# EAGLE schematic Small_Ethernet (EAGLE 7.3.0)
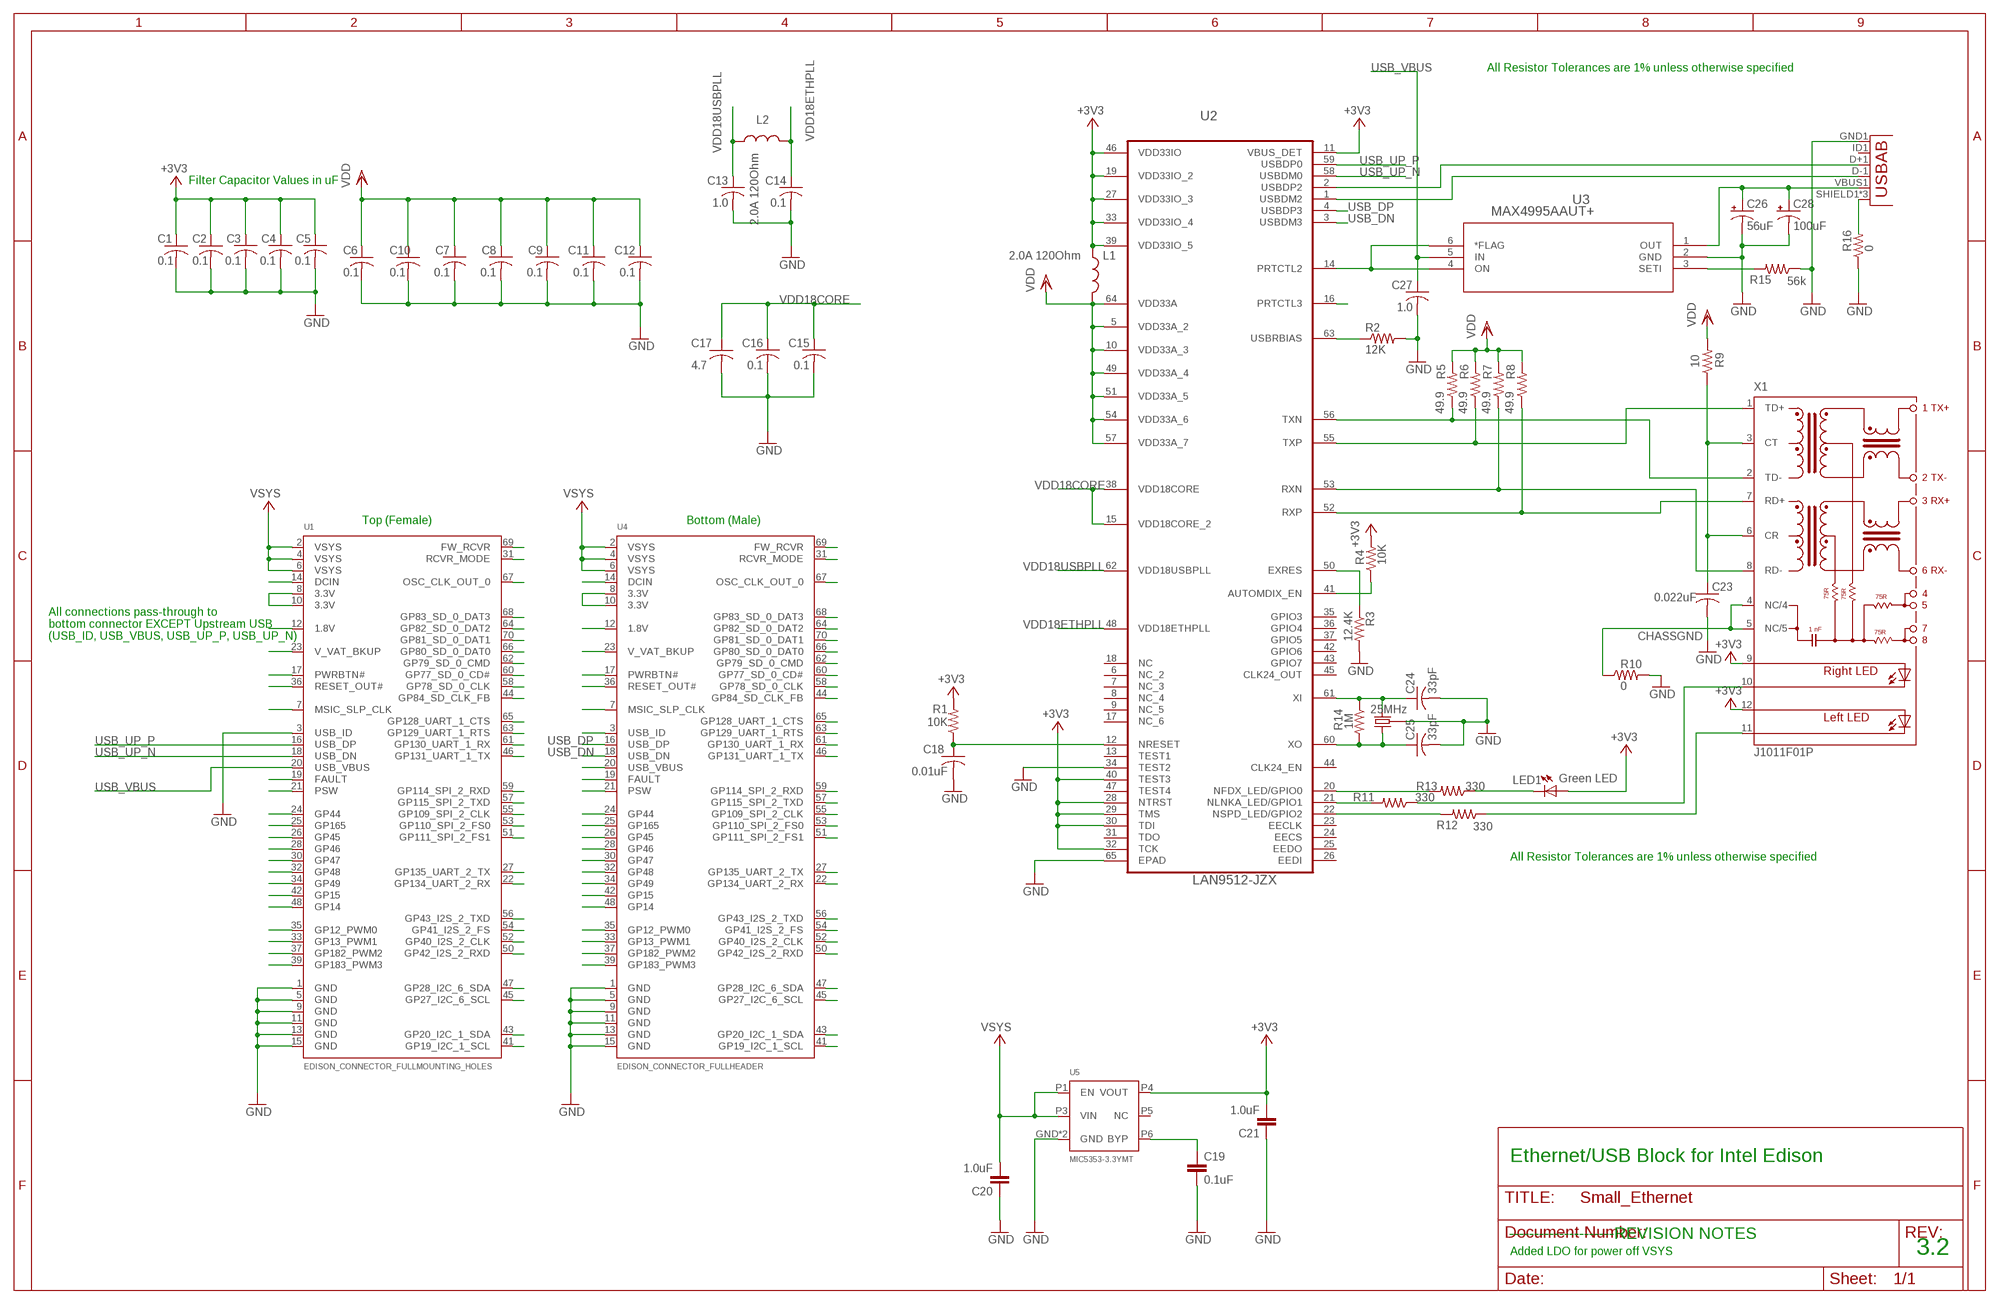
[diagram p0: schematic, sheet 1]

## Parts
C1  0.1  C-USC0402K  [C0402K]
C2  0.1  C-USC0402K  [C0402K]
C3  0.1  C-USC0402K  [C0402K]
C4  0.1  C-USC0402K  [C0402K]
C5  0.1  C-USC0402K  [C0402K]
C6  0.1  C-USC0402K  [C0402K]
C7  0.1  C-USC0402K  [C0402K]
C8  0.1  C-USC0402K  [C0402K]
C9  0.1  C-USC0402K  [C0402K]
C10  0.1  C-USC0402K  [C0402K]
C11  0.1  C-USC0402K  [C0402K]
C12  0.1  C-USC0402K  [C0402K]
C13  1.0  C-USC0402K  [C0402K]
C14  0.1  C-USC0402K  [C0402K]
C15  0.1  C-USC0402K  [C0402K]
C16  0.1  C-USC0402K  [C0402K]
C17  4.7  C-USC0603K  [C0603K]
C18  0.01uF  C-USC0603K  [C0603K]
C19  0.1uF  0.1UF-16V(+-10%)(0402)  [0402-CAP]
C20  1.0uF  1.0UF-16V-10%(0402)  [0402-CAP]
C21  1.0uF  1.0UF-16V-10%(0402)  [0402-CAP]
C23  0.022uF  C-USC0805  [C0805]
C24  33pF  C-USC0402  [C0402]
C25  33pF  C-USC0402  [C0402]
C26  56uF  EEF-CXXXXXXX  [CAP-2917]
C27  1.0  C-USC0402K  [C0402K]
C28  100uF  EEF-CXXXXXXX  [CAP-2917]
JP1  USB-ABCONN-11794  [USB-AB-MICRO-SMD_V03]
L1  2.0A 120Ohm  L-US0603  [L0603]
L2  2.0A 120Ohm  L-US0603  [L0603]
LED1  Green LED  LEDCHIP-LED0805  [CHIP-LED0805]
R1  10K  R-US_R0603  [R0603]
R2  12K  R-US_R0603  [R0603]
R3  12.4K  R-US_R0603  [R0603]
R4  10K  R-US_R0603  [R0603]
R5  49.9  R-US_R0402  [R0402]
R6  49.9  R-US_R0402  [R0402]
R7  49.9  R-US_R0402  [R0402]
R8  49.9  R-US_R0402  [R0402]
R9  10  R-US_R0402  [R0402]
R10  0  R-US_R1210  [R1210]
R11  330  R-US_R0402  [R0402]
R12  330  R-US_R0402  [R0402]
R13  330  R-US_R0402  [R0402]
R14  1M  R-US_R0402  [R0402]
R15  56k  R-US_R0603  [R0603]
R16  0  R-US_R1210  [R1210]
U1  EDISON_CONNECTOR_FULLMOUNTING_HOLES  [EDISON_DAUGHTER]
U2  LAN9512-JZX  [QFN50P900X900X100-65N]
U3  MAX4995AAUT+  [21-0058I]
U4  EDISON_CONNECTOR_FULLHEADER  [DF40C-70DP-0.4(51)]
U5  MIC5353-3.3YMT  MIC5353-XXYMT  [6-UFDFN]
U$1  25MHz  CRYSTAL-ESC-32  [SMDCRYSTAL_3.2X2.5]
X1  J1011F01P  [J1]

## Nets
+3V3: C1.1 C2.1 C3.1 C4.1 C5.1 C21.2 L1.1 LED1.A R1.2 R4.2 U2.11(VBUS_DET) U2.19(VDD33IO_2) U2.27(VDD33IO_3) U2.28(NTRST) U2.29(TMS) U2.30(TDI) U2.32(TCK) U2.33(VDD33IO_4) U2.39(VDD33IO_5) U2.40(TEST3) U2.46(VDD33IO) U5.P4(VOUT) X1.9(A-R) X1.12(AL)
CHASSGND: R10.1 X1.4(NC/4) X1.5(NC/5)
DSUSB_N: JP1.D-1(D-) U2.1(USBDM2)
DSUSB_P: JP1.D+1(D+) U2.2(USBDP2)
ED3V: U1.8(3.3V) U1.10(3.3V) U4.8(3.3V) U4.10(3.3V)
GND: C1.2 C2.2 C3.2 C4.2 C5.2 C6.2 C7.2 C8.2 C9.2 C10.2 C11.2 C12.2 C13.2 C14.2 C15.2 C16.2 C17.2 C18.2 C19.2 C20.1 C21.1 C23.2 C24.2 C25.2 C26.NEG(-) C27.2 C28.NEG(-) JP1.GND1(GND) R2.2 R3.2 R10.2 R15.1 R16.1 U1.1(GND) U1.3(USB_ID) U1.5(GND) U1.9(GND) U1.11(GND) U1.13(GND) U1.15(GND) U2.34(TEST2) U2.65(EPAD) U3.2(GND) U4.1(GND) U4.5(GND) U4.9(GND) U4.11(GND) U4.13(GND) U4.15(GND) U5.GND U5.P2(GND) U$1.P2_GND U$1.P4_GND
N$1: C19.1 U5.P6(BYP)
N$2: JP1.SHIELD1(SHIELD) JP1.SHIELD2(SHIELD) JP1.SHIELD3(SHIELD)
N$3: U2.16(PRTCTL3)
N$6: R2.1 U2.63(USBRBIAS)
N$7: C18.1 R1.1 U2.12(NRESET)
N$8: R3.1 U2.50(EXRES)
N$9: R4.1 U2.41(AUTOMDIX_EN)
N$10: C23.1 R9.1 X1.3(CT) X1.6(CR)
N$15: R11.2 U2.21(NLNKA_LED/GPIO1)
N$16: R11.1 X1.10(C-R)
N$17: R12.1 X1.11(C-L)
N$18: R12.2 U2.22(NSPD_LED/GPIO2)
N$19: LED1.C R13.1
N$20: R13.2 U2.20(NFDX_LED/GPIO0)
N$21: C24.1 R14.1 U2.61(XI) U$1.P3_O/I
N$22: C25.1 R14.2 U2.60(XO) U$1.P1_I/O
N$23: U2.14(PRTCTL2) U3.4(ON) U3.6(*FLAG)
N$25: C26.POS(+) C28.POS(+) JP1.VBUS1(VBUS) U3.1(OUT)
N$26: R15.2 U3.3(SETI)
P3: U4.3(USB_ID)
P7: U1.7(MSIC_SLP_CLK) U4.7(MSIC_SLP_CLK)
P12: U1.12(1.8V) U4.12(1.8V)
P14: U1.14(DCIN) U4.14(DCIN)
P17: U1.17(PWRBTN#) U4.17(PWRBTN#)
P19: U1.19(FAULT) U4.19(FAULT)
P21: U1.21(PSW) U4.21(PSW)
P22: U1.22(GP134_UART_2_RX) U4.22(GP134_UART_2_RX)
P23: U1.23(V_VAT_BKUP) U4.23(V_VAT_BKUP)
P24: U1.24(GP44) U4.24(GP44)
P25: U1.25(GP165) U4.25(GP165)
P26: U1.26(GP45) U4.26(GP45)
P27: U1.27(GP135_UART_2_TX) U4.27(GP135_UART_2_TX)
P28: U1.28(GP46) U4.28(GP46)
P30: U1.30(GP47) U4.30(GP47)
P31: U1.31(RCVR_MODE) U4.31(RCVR_MODE)
P32: U1.32(GP48) U4.32(GP48)
P33: U1.33(GP13_PWM1) U4.33(GP13_PWM1)
P34: U1.34(GP49) U4.34(GP49)
P35: U1.35(GP12_PWM0) U4.35(GP12_PWM0)
P36: U1.36(RESET_OUT#) U4.36(RESET_OUT#)
P37: U1.37(GP182_PWM2) U4.37(GP182_PWM2)
P39: U1.39(GP183_PWM3) U4.39(GP183_PWM3)
P41: U1.41(GP19_I2C_1_SCL) U4.41(GP19_I2C_1_SCL)
P42: U1.42(GP15) U4.42(GP15)
P43: U1.43(GP20_I2C_1_SDA) U4.43(GP20_I2C_1_SDA)
P44: U1.44(GP84_SD_CLK_FB) U4.44(GP84_SD_CLK_FB)
P45: U1.45(GP27_I2C_6_SCL) U4.45(GP27_I2C_6_SCL)
P46: U1.46(GP131_UART_1_TX) U4.46(GP131_UART_1_TX)
P47: U1.47(GP28_I2C_6_SDA) U4.47(GP28_I2C_6_SDA)
P48: U1.48(GP14) U4.48(GP14)
P50: U1.50(GP42_I2S_2_RXD) U4.50(GP42_I2S_2_RXD)
P51: U1.51(GP111_SPI_2_FS1) U4.51(GP111_SPI_2_FS1)
P52: U1.52(GP40_I2S_2_CLK) U4.52(GP40_I2S_2_CLK)
P53: U1.53(GP110_SPI_2_FS0) U4.53(GP110_SPI_2_FS0)
P54: U1.54(GP41_I2S_2_FS) U4.54(GP41_I2S_2_FS)
P55: U1.55(GP109_SPI_2_CLK) U4.55(GP109_SPI_2_CLK)
P56: U1.56(GP43_I2S_2_TXD) U4.56(GP43_I2S_2_TXD)
P57: U1.57(GP115_SPI_2_TXD) U4.57(GP115_SPI_2_TXD)
P58: U1.58(GP78_SD_0_CLK) U4.58(GP78_SD_0_CLK)
P59: U1.59(GP114_SPI_2_RXD) U4.59(GP114_SPI_2_RXD)
P60: U1.60(GP77_SD_0_CD#) U4.60(GP77_SD_0_CD#)
P61: U1.61(GP130_UART_1_RX) U4.61(GP130_UART_1_RX)
P62: U1.62(GP79_SD_0_CMD) U4.62(GP79_SD_0_CMD)
P63: U1.63(GP129_UART_1_RTS) U4.63(GP129_UART_1_RTS)
P64: U1.64(GP82_SD_0_DAT2) U4.64(GP82_SD_0_DAT2)
P65: U1.65(GP128_UART_1_CTS) U4.65(GP128_UART_1_CTS)
P66: U1.66(GP80_SD_0_DAT0) U4.66(GP80_SD_0_DAT0)
P67: U1.67(OSC_CLK_OUT_0) U4.67(OSC_CLK_OUT_0)
P68: U1.68(GP83_SD_0_DAT3) U4.68(GP83_SD_0_DAT3)
P69: U1.69(FW_RCVR) U4.69(FW_RCVR)
P70: U1.70(GP81_SD_0_DAT1) U4.70(GP81_SD_0_DAT1)
RX_N: R8.1 U2.52(RXP) X1.7(RD+)
RX_P: R7.1 U2.53(RXN) X1.8(RD-)
TX_N: R5.1 U2.56(TXN) X1.2(TD-)
TX_P: R6.1 U2.55(TXP) X1.1(TD+)
USB_DN: U2.3(USBDM3) U4.18(USB_DN)
USB_DP: U2.4(USBDP3) U4.16(USB_DP)
USB_UP_N: U1.18(USB_DN) U2.58(USBDM0)
USB_UP_P: U1.16(USB_DP) U2.59(USBDP0)
USB_VBUS: C27.1 U1.20(USB_VBUS) U3.5(IN) U4.20(USB_VBUS)
VCC: C20.2 U1.2(VSYS) U1.4(VSYS) U1.6(VSYS) U4.2(VSYS) U4.4(VSYS) U4.6(VSYS) U5.P1(EN) ; supply symbol labelled VSYS
VDD18CORE: C15.1 C16.1 C17.1 U2.15(VDD18CORE_2) U2.38(VDD18CORE)
VDD18ETHPLL: C14.1 L2.2 U2.48(VDD18ETHPLL)
VDD18USBPLL: C13.1 L2.1 U2.62(VDD18USBPLL)
VDD33A: C6.1 C7.1 C8.1 C9.1 C10.1 C11.1 C12.1 L1.2 R5.2 R6.2 R7.2 R8.2 R9.2 U2.5(VDD33A_2) U2.10(VDD33A_3) U2.49(VDD33A_4) U2.51(VDD33A_5) U2.54(VDD33A_6) U2.57(VDD33A_7) U2.64(VDD33A) ; supply symbol labelled VDD
Unconnected: JP1.ID1(USBID) R16.2 U2.6(NC_2) U2.7(NC_3) U2.8(NC_4) U2.9(NC_5) U2.13(TEST1) U2.17(NC_6) U2.18(NC) U2.23(EECLK) U2.24(EECS) U2.25(EEDO) U2.26(EEDI) U2.31(TDO) U2.35(GPIO3) U2.36(GPIO4) U2.37(GPIO5) U2.42(GPIO6) U2.43(GPIO7) U2.44(CLK24_EN) U2.45(CLK24_OUT) U2.47(TEST4) U5.P3(VIN) U5.P5(NC)

## Notes on the sheet
- All Resistor Tolerances are 1% unless otherwise specified
- Filter Capacitor Values in uF
- Top (Female) | Bottom (Male)
- All connections pass-through to 
  bottom connector EXCEPT Upstream USB
  (USB_ID, USB_VBUS, USB_UP_P, USB_UP_N)
- All Resistor Tolerances are 1% unless otherwise specified
- Ethernet/USB Block for Intel Edison
- ---------------------REVISION NOTES
- Added LDO for power off VSYS | 3.2

## Library data of the parts
C1-C18 C24 C25 C27 = rcl:C-US: CAPACITOR, American symbol
C19 = SparkFun-Capacitors:0.1UF-16V(+-10%)(0402); PROD_ID: CAP-12416
C20 C21 = SparkFun-Capacitors:1.0UF-16V-10%(0402); PROD_ID: CAP-12417
C23 = resistor:C-US: CAPACITOR, American symbol
C26 C28 = PoEdev:EEF-CXXXXXXX
JP1 = SparkFun-Connectors:USB-AB: This is a USB AB connector that is compatible with USB OTG. i.e. this connector can serve as a host or device; PROD_ID: CONN-11794
L1 L2 = murata-inductors:L-US
LED1 = led:LED: LED OSRAM: - CHIPLED LG R971, LG N971, LY N971, LG Q971, LY Q971, LO R971, LY R971 LH N974, LH R974 LS Q976, LO Q976, LY Q976 LO Q996 - Hyper CHIPLED LW Q18S LB Q993, LB Q99A, LB R99A - SideLED LS A670, LO A670, LY A670, LG A670, LP A670 LB A673, LV A673, LT A673, LW A673 LH A674 LY A675 LS A676, LA A676, LO A676, LY A676, LW A676 LS A679, LY A679, LG A679 - Hyper Micro SIDELED® LS Y876, LA Y876, LO Y876, LY Y876 LT Y87S - SmartLED LW L88C, LW L88S LB L89C, LB L89S, LG L890 LS L89K, LO L89K, LY L89K LS L896, LA L896, LO L896, LY L896 - TOPLED LS T670, LO T670, LY T670, LG T670, LP T670 LSG T670, LSP T670, LSY T670, LOP T670, LYG T670 LG T671, LOG T671, LSG T671 LB T673, LV T673, LT T673, LW T673 LH T674 LS T676, LA T676, LO T676, LY T676, LB T676, LH T676, LSB T676, LW T676 LB T67C, LV T67C, LT T67C, LS T67K, LO T67K, LY T67K, LW E67C LS E67B, LA E67B, LO E67B, LY E67B, LB E67C, LV E67C, LT E67C LW T67C LS T679, LY T679, LG T679 LS T770, LO T770, LY T770, LG T770, LP T770 LB T773, LV T773, LT T773, LW T773 LH T774 LS E675, LA E675, LY E675, LS T675 LS T776, LA T776, LO T776, LY T776, LB T776 LHGB T686 LT T68C, LB T68C - Hyper Mini TOPLED® LB M676 - Mini TOPLED Santana® LG M470 LS M47K, LO M47K, LY M47K Source: http://www.osram.convergy.de LUXEON: - LUMILED® LXK2-PW12-R00, LXK2-PW12-S00, LXK2-PW14-U00, LXK2-PW14-V00 LXK2-PM12-R00, LXK2-PM12-S00, LXK2-PM14-U00 LXK2-PE12-Q00, LXK2-PE12-R00, LXK2-PE12-S00, LXK2-PE14-T00, LXK2-PE14-U00 LXK2-PB12-K00, LXK2-PB12-L00, LXK2-PB12-M00, LXK2-PB14-N00, LXK2-PB14-P00, LXK2-PB14-Q00 LXK2-PR12-L00, LXK2-PR12-M00, LXK2-PR14-Q00, LXK2-PR14-R00 LXK2-PD12-Q00, LXK2-PD12-R00, LXK2-PD12-S00 LXK2-PH12-R00, LXK2-PH12-S00 LXK2-PL12-P00, LXK2-PL12-Q00, LXK2-PL12-R00 Source: www.luxeon.com KINGBRIGHT: KA-3528ASYC Source: www.kingbright.com
R1-R14 R16 = resistor:R-US_: RESISTOR, American symbol
R15 = rcl:R-US_: RESISTOR, American symbol
U1 U4 = Edison:EDISON_CONNECTOR_FULL
U2 = Lan9512:LAN9512-JZX: IC, USB2 - ENET CNTRL 2-PORT HUB, 64VQFN; MPN: LAN9512-JZX; OC_FARNELL: 2292586; OC_NEWARK: 66W1988; PACKAGE: 64VQFN; SUPPLIER: Microchip
U3 = MAX4995:MAX4995AAUT+: Programmable current-limit switch; MANUFACTURER_PART_NUMBER: max4995aaut+; VENDOR: MAXIM
U5 = PoEdev:MIC5353-XXYMT
U$1 = PoEdev:CRYSTAL-ESC-32
X1 = con-pulse:J1011F: PULSEJACK (TM) 1x1 Tab-UP RJ45 10/100 Base-TX RJ45 1x1 Tab-UP with LEDs 8-pin (J1 series) and 6-pin (JP series) integrated magnetics connector, designed to support applications, such as ADSL modems, LAN-on-Motherboard, and Hub and Switches. Source: www.pulseeng.com .. PulseJack-J402.pdf; OC_FARNELL: unknown; OC_NEWARK: unknown